# Altium schematic sheet FonteTensão.SchDoc
size A4; Engineer: Kayann Soares; SheetNumber: 9; SheetTotal: 11; CompanyInfo1: Universidade Federal do Ceará; CompanyInfo2: Centro de Tecnologia - CT; CompanyInfo3: Dep. de Eng. de Teleinformática
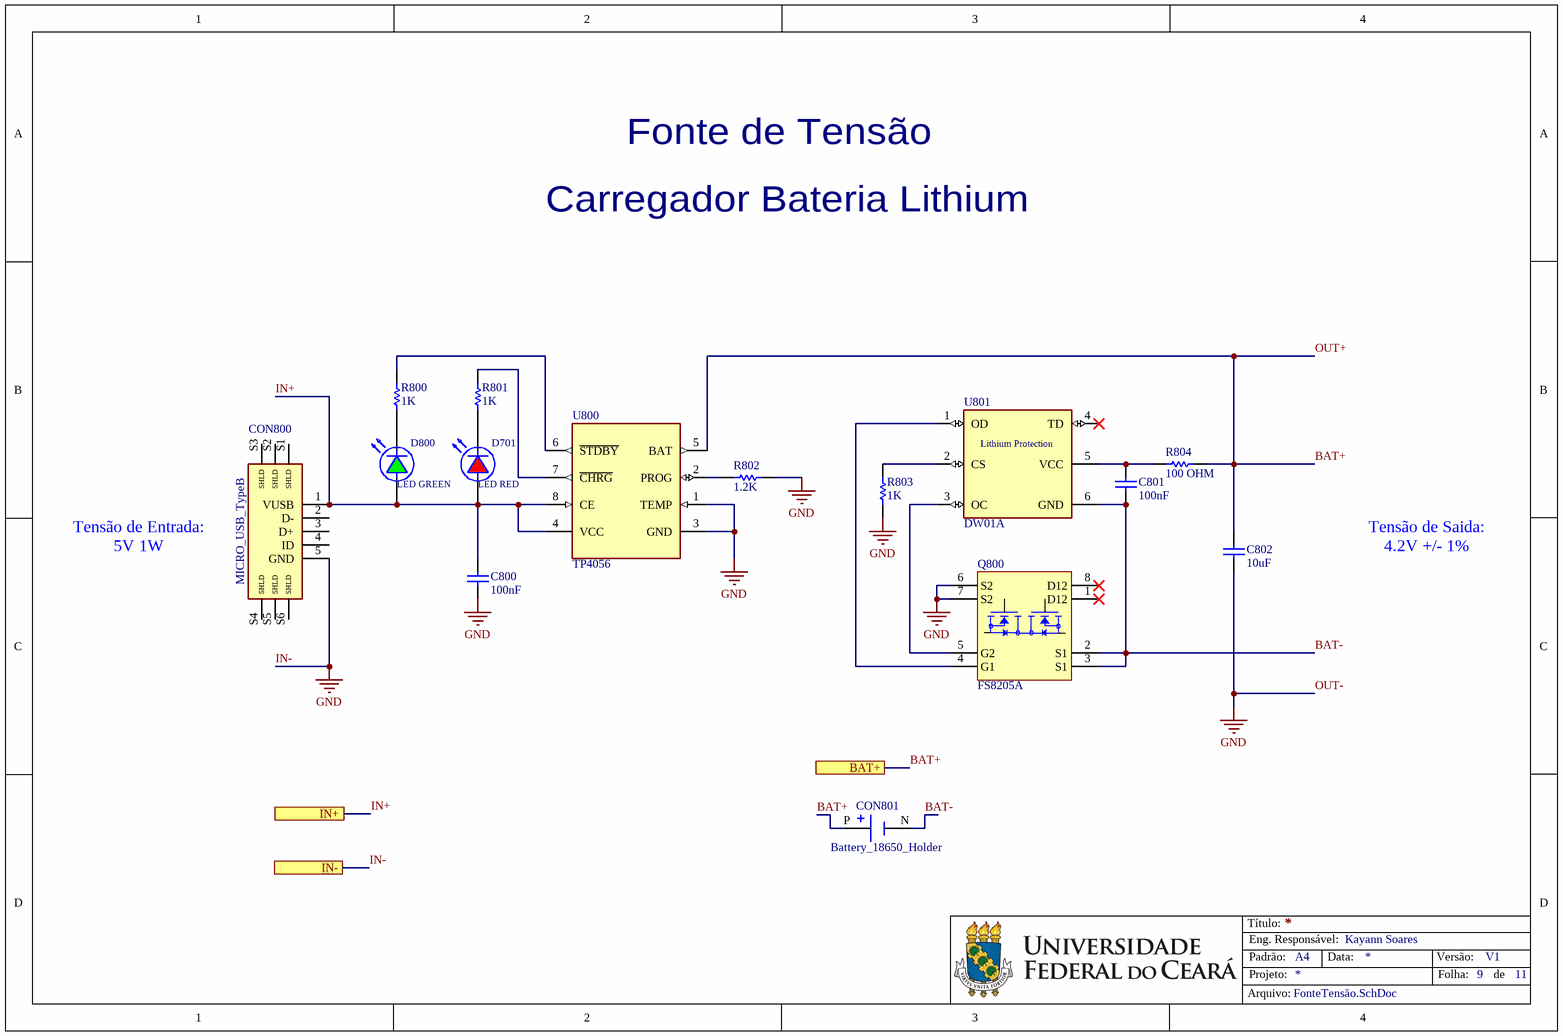
[diagram p0: FonteTensão.SchDoc]

## Parts
C800  100nF
C801  100nF
C802  10uF  [CAP_CER_0805]
CON800  MICRO_USB_TypeB  [MICRO_USB_TypeB]
CON801  Battery_18650_Holder  [Battery_18650_Holder]
D701  LED RED  [LED_RED_SMD_0603]
D800  LED GREEN  [LED_GREEN_SMD_0603]
Q800  FS8205A  [FS8205A]
R800  1K  [RES_0603]
R801  1K  [RES_0603]
R802  1.2K  [CAP_CER_0805]
R803  1K  [RES_0603]
R804  100 OHM  [RES_0603]
U800  TP4056  [TP4056]
U801  DW01A  [DW01A]

## Ports
BAT+, IN+, IN-

## Nets
IN-: C800.1 C802.1 CON800.5(GND) Q800.6(S2) Q800.7(S2) R802.2 R803.1 U800.1(TEMP) U800.3(GND) ; port IN-  [also labelled GND, OUT-]
BAT+: C802.2 CON801.P(POS) R804.2 U800.5(BAT) ; port BAT+  [also labelled OUT+]
BAT-: C801.1 CON801.N(NEG) Q800.2(S1) Q800.3(S1) U801.6(GND)
IN+: C800.2 CON800.1(VUSB) D701.A D800.A U800.4(VCC) U800.8(CE) ; port IN+
NetC801_2: C801.2 R804.1 U801.5(VCC)
NetD701_K: D701.K R801.1
NetD800_K: D800.K R800.1
NetQ800_4: Q800.4(G1) U801.1(OD)
NetQ800_5: Q800.5(G2) U801.3(OC)
NetR800_2: R800.2 U800.6(~{STDBY})
NetR801_2: R801.2 U800.7(~{CHRG})
NetR802_1: R802.1 U800.2(PROG)
NetR803_2: R803.2 U801.2(CS)

Not connected (* = marked no-connect by the designer): CON800 2(D-) 3(D+) 4(ID) S1(SHLD) S2(SHLD) S3(SHLD) S4(SHLD) S5(SHLD) S6(SHLD); Q800 1(D12)* 8(D12)*; U801 4(TD)*

## Notes on the sheet
- Fonte de Tensão
- Carregador Bateria Lithium
- (near CON800) Tensão de Entrada: 5V 1W
- Tensão de Saida: 4.2V +/- 1%
- Título:
- Padrão:
- Projeto:
- Eng. Responsável:
- A4
- Data:
- Versão:
- Folha:
- V1
- de
- Arquivo:
- (in symbol DW01A) Lithium Protection

## Library data of the parts
C800 C801 = CAP_CER_100nF_0603: Supplier 1: Arrow Electronics; Supplier Part Number 1: 02016C104KAT2A
C802 = CAP_CER_10uF_0805: Supplier 1: Arrow Electronics; Supplier Part Number 1: CL21A106KOQNNNE
D701 = LED_RED_SMD_0603: Supplier 1: Digi-Key; Supplier Part Number 1: 754-1117-1-ND
D800 = LED_GREEN_SMD_0603: Supplier 1: Digi-Key; Supplier Part Number 1: 754-1121-1-ND
R800 R801 R803 = RES_1K_0603: Supplier 1: Future Electronics; Supplier Part Number 1: 4016291
R802 = RES_1.2K_0805: Supplier 1: Newark; Supplier Part Number 1: 74AJ8198
R804 = RES_100OHM_0603: Supplier 1: Future Electronics; Supplier Part Number 1: 7334493
CON800 = MICRO_USB_TypeB: Supplier 1: Avnet; Supplier Part Number 1: 10118193-0001LF
U801 = DW01A: Supplier 1: LCSC; Supplier Part Number 1: C351410